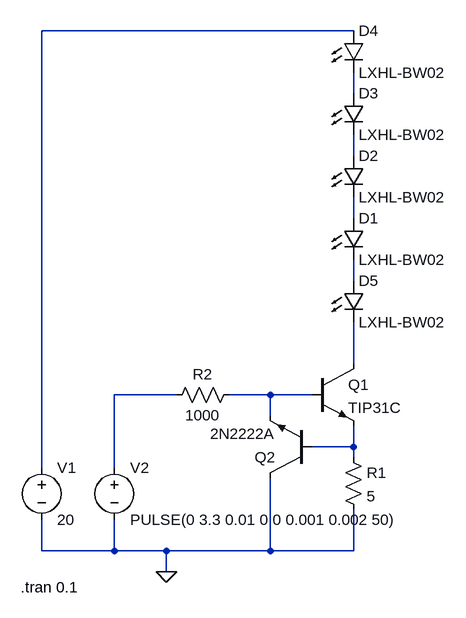
[diagram p0: schematic currentsource.asc]
currentsource.asc, the LTspice schematic file:
Version 4
SHEET 1 880 680
WIRE 240 -560 -240 -560
WIRE 240 -464 240 -496
WIRE 240 -368 240 -400
WIRE 240 -272 240 -304
WIRE 240 -176 240 -208
WIRE 240 -48 240 -112
WIRE -32 0 -128 0
WIRE 112 0 48 0
WIRE 176 0 112 0
WIRE 112 32 112 0
WIRE 240 80 240 48
WIRE 240 80 176 80
WIRE 240 96 240 80
WIRE -240 112 -240 -560
WIRE -128 112 -128 0
WIRE -240 240 -240 192
WIRE -128 240 -128 192
WIRE -128 240 -240 240
WIRE -48 240 -128 240
WIRE 112 240 112 128
WIRE 112 240 -48 240
WIRE 240 240 240 176
WIRE 240 240 112 240
WIRE -48 272 -48 240
FLAG -48 272 0
SYMBOL npn 176 -48 R0
SYMATTR InstName Q1
SYMATTR Value TIP31C
SYMBOL voltage -240 96 R0
WINDOW 123 0 0 Left 0
WINDOW 39 0 0 Left 0
SYMATTR InstName V1
SYMATTR Value 20
SYMBOL res 224 80 R0
SYMATTR InstName R1
SYMATTR Value 5
SYMBOL LED 224 -176 R0
SYMATTR InstName D5
SYMATTR Value LXHL-BW02
SYMATTR Description Diode
SYMATTR Type diode
SYMBOL voltage -128 96 R0
WINDOW 123 0 0 Left 0
WINDOW 39 0 0 Left 0
SYMATTR InstName V2
SYMATTR Value PULSE(0 3.3 0.01 0 0 0.001 0.002 50)
SYMBOL npn 176 128 R180
SYMATTR InstName Q2
SYMATTR Value 2N2222A
SYMBOL res 64 -16 R90
WINDOW 0 0 56 VBottom 2
WINDOW 3 32 56 VTop 2
SYMATTR InstName R2
SYMATTR Value 1000
SYMBOL LED 224 -272 R0
SYMATTR InstName D1
SYMATTR Value LXHL-BW02
SYMATTR Description Diode
SYMATTR Type diode
SYMBOL LED 224 -368 R0
SYMATTR InstName D2
SYMATTR Value LXHL-BW02
SYMATTR Description Diode
SYMATTR Type diode
SYMBOL LED 224 -464 R0
SYMATTR InstName D3
SYMATTR Value LXHL-BW02
SYMATTR Description Diode
SYMATTR Type diode
SYMBOL LED 224 -560 R0
SYMATTR InstName D4
SYMATTR Value LXHL-BW02
SYMATTR Description Diode
SYMATTR Type diode
TEXT -272 296 Left 2 !.tran 0.1

The netlist it stands for:
* currentsource.asc
Q1 N006 N008 N009 0 TIP31C
V1 N001 0 20
R1 N009 0 5
D5 N005 N006 LXHL-BW02
V2 N007 0 PULSE(0 3.3 0.01 0 0 0.001 0.002 50)
Q2 0 N009 N008 0 2N2222A
R2 N008 N007 1000
D1 N004 N005 LXHL-BW02
D2 N003 N004 LXHL-BW02
D3 N002 N003 LXHL-BW02
D4 N001 N002 LXHL-BW02
.model D D
.lib standard.dio
.model NPN NPN
.model PNP PNP
.lib standard.bjt
.tran 0.1
.backanno
.end